# Altium schematic sheet Sheet1.SchDoc
size A4; SheetNumber: 1; SheetTotal: 1
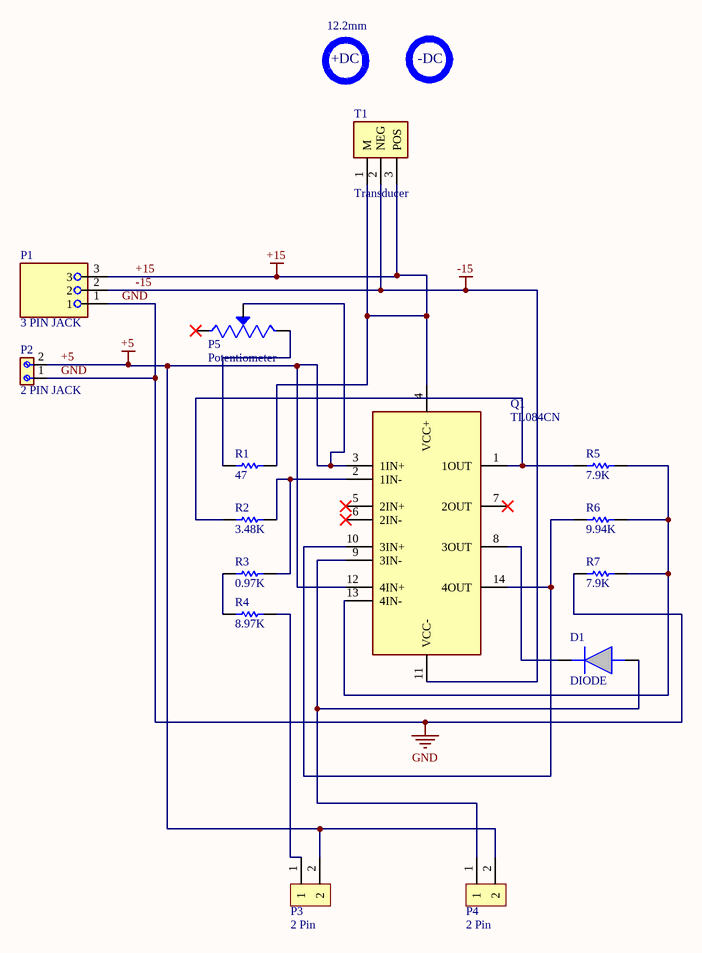
[diagram p0: Sheet1.SchDoc]

## Parts
D1  DIODE  [Diode]
P1  3 PIN JACK  [3 PIN JACK]
P2  2 PIN JACK  [2 PIN JACK]
P3  2 Pin  [2 PIN]
P4  2 Pin  [2 PIN]
P5  Potentiometer  [Potentiometer]
Q1  TL084CN  [TL084CN]
R1  47  [47]
R2  3.48K  [3.48K]
R3  0.97K  [0.97K]
R4  8.97K  [8.97K]
R5  7.9K  [7.90K]
R6  9.94K  [9.94K]
R7  7.9K  [7.90K]
T1  Transducer  [Transducer]

## Nets
+5: P2.2 P3.2 P4.2 P5.2(WIPER) Q1.3(1IN+) Q1.12(4IN+)
+15: P1.3 Q1.4(VCC+) R1.2 T1.1(M) T1.3(POS)
-15: P1.2 Q1.11(VCC-) T1.2(NEG)
GND: P1.1 P2.1 R7.1
NetD1_1: D1.1(K) Q1.8(3OUT)
NetD1_2: D1.2(A) P4.1 Q1.9(3IN-)
NetP3_1: P3.1 R4.2
NetP5_3: P5.3(CW) R1.1
NetQ1_1: Q1.1(1OUT) R2.1 R5.1
NetQ1_2: Q1.2(1IN-) R2.2 R3.2
NetQ1_10: Q1.10(3IN+) Q1.14(4OUT) R6.1
NetQ1_13: Q1.13(4IN-) R5.2 R6.2 R7.2
NetR3_1: R3.1 R4.1

Not connected (* = marked no-connect by the designer): P5 1(CCW)*; Q1 5(2IN+)* 6(2IN-)* 7(2OUT)*

## Notes on the sheet
- 12.2mm
- +DC
- -DC

## Library data of the parts
D1 = DIODE: 1N4007S
P3 P4 = 2 Pin: 22272021
R1 = 47: MFR-25FRF52-47R
R2 = 3.48K: MFR-25FBF52-3K48
R3 = 0.97K: MFR-25FRF52-976R
R4 = 8.97K: MFR-25FBF52-8K87
R5 R7 = 7.9K: MFR-25FBF52-7K87
R6 = 9.94K: MFR-25FTE52-9K76
T1 = Transducer: LA55-P